# Altium schematic sheet main.SchDoc
size 840 x 594 mm; PageSetup: Record=PageOptions|CenterHorizontal=False|CenterVertical=False|PrintScale=1.00|XCorrection=0.00|YCorrection=0.00|PrintKind=0|BorderSize=5000000|LeftOffset=0|BottomOffset=0|Orientation=2|PaperLength=1000|PaperWidth=1000|Scale=100|PaperSource=15|PrintQuality=-3|MediaType=1|DitherType=10|PrintScaleMode=0|PaperKind=A3|PaperIndex=8; TitleBlock_01a_DocumentName_line1: BoM Converter; TitleBlock_01a_DocumentName_line2: отладочный проект AD; TitleBlock_01b_DocumentType_line1: Схема электрическая; TitleBlock_01b_DocumentType_line2: принципиальная; TitleBlock_02_DocumentDesignator: BCAD.123456.001 Э3; TitleBlock_07_SheetNumber: 1; TitleBlock_08_SheetTotal: 1; TitleBlock_09_Organization: ООО "НИИ БАЦА"; TitleBlock_11a_Name_Designer: Иванов И.И.; TitleBlock_11b_Name_Checker: Петров П.П.; TitleBlock_11c_Name_TechnicalSupervisor: Сидоров С.С.; TitleBlock_11e_Name_NormativeSupervisor: Зюзина В.Н.; TitleBlock_11f_Name_Approver: Горшков А.С.; TitleBlock_13a_SignatureDate_Designer: 07.10.22; TitleBlock_13b_SignatureDate_Checker: 07.10.22; TitleBlock_13c_SignatureDate_TechnicalSupervisor: 07.10.22; TitleBlock_13e_SignatureDate_NormativeSupervisor: 07.10.22; TitleBlock_13f_SignatureDate_Approver: 07.10.22
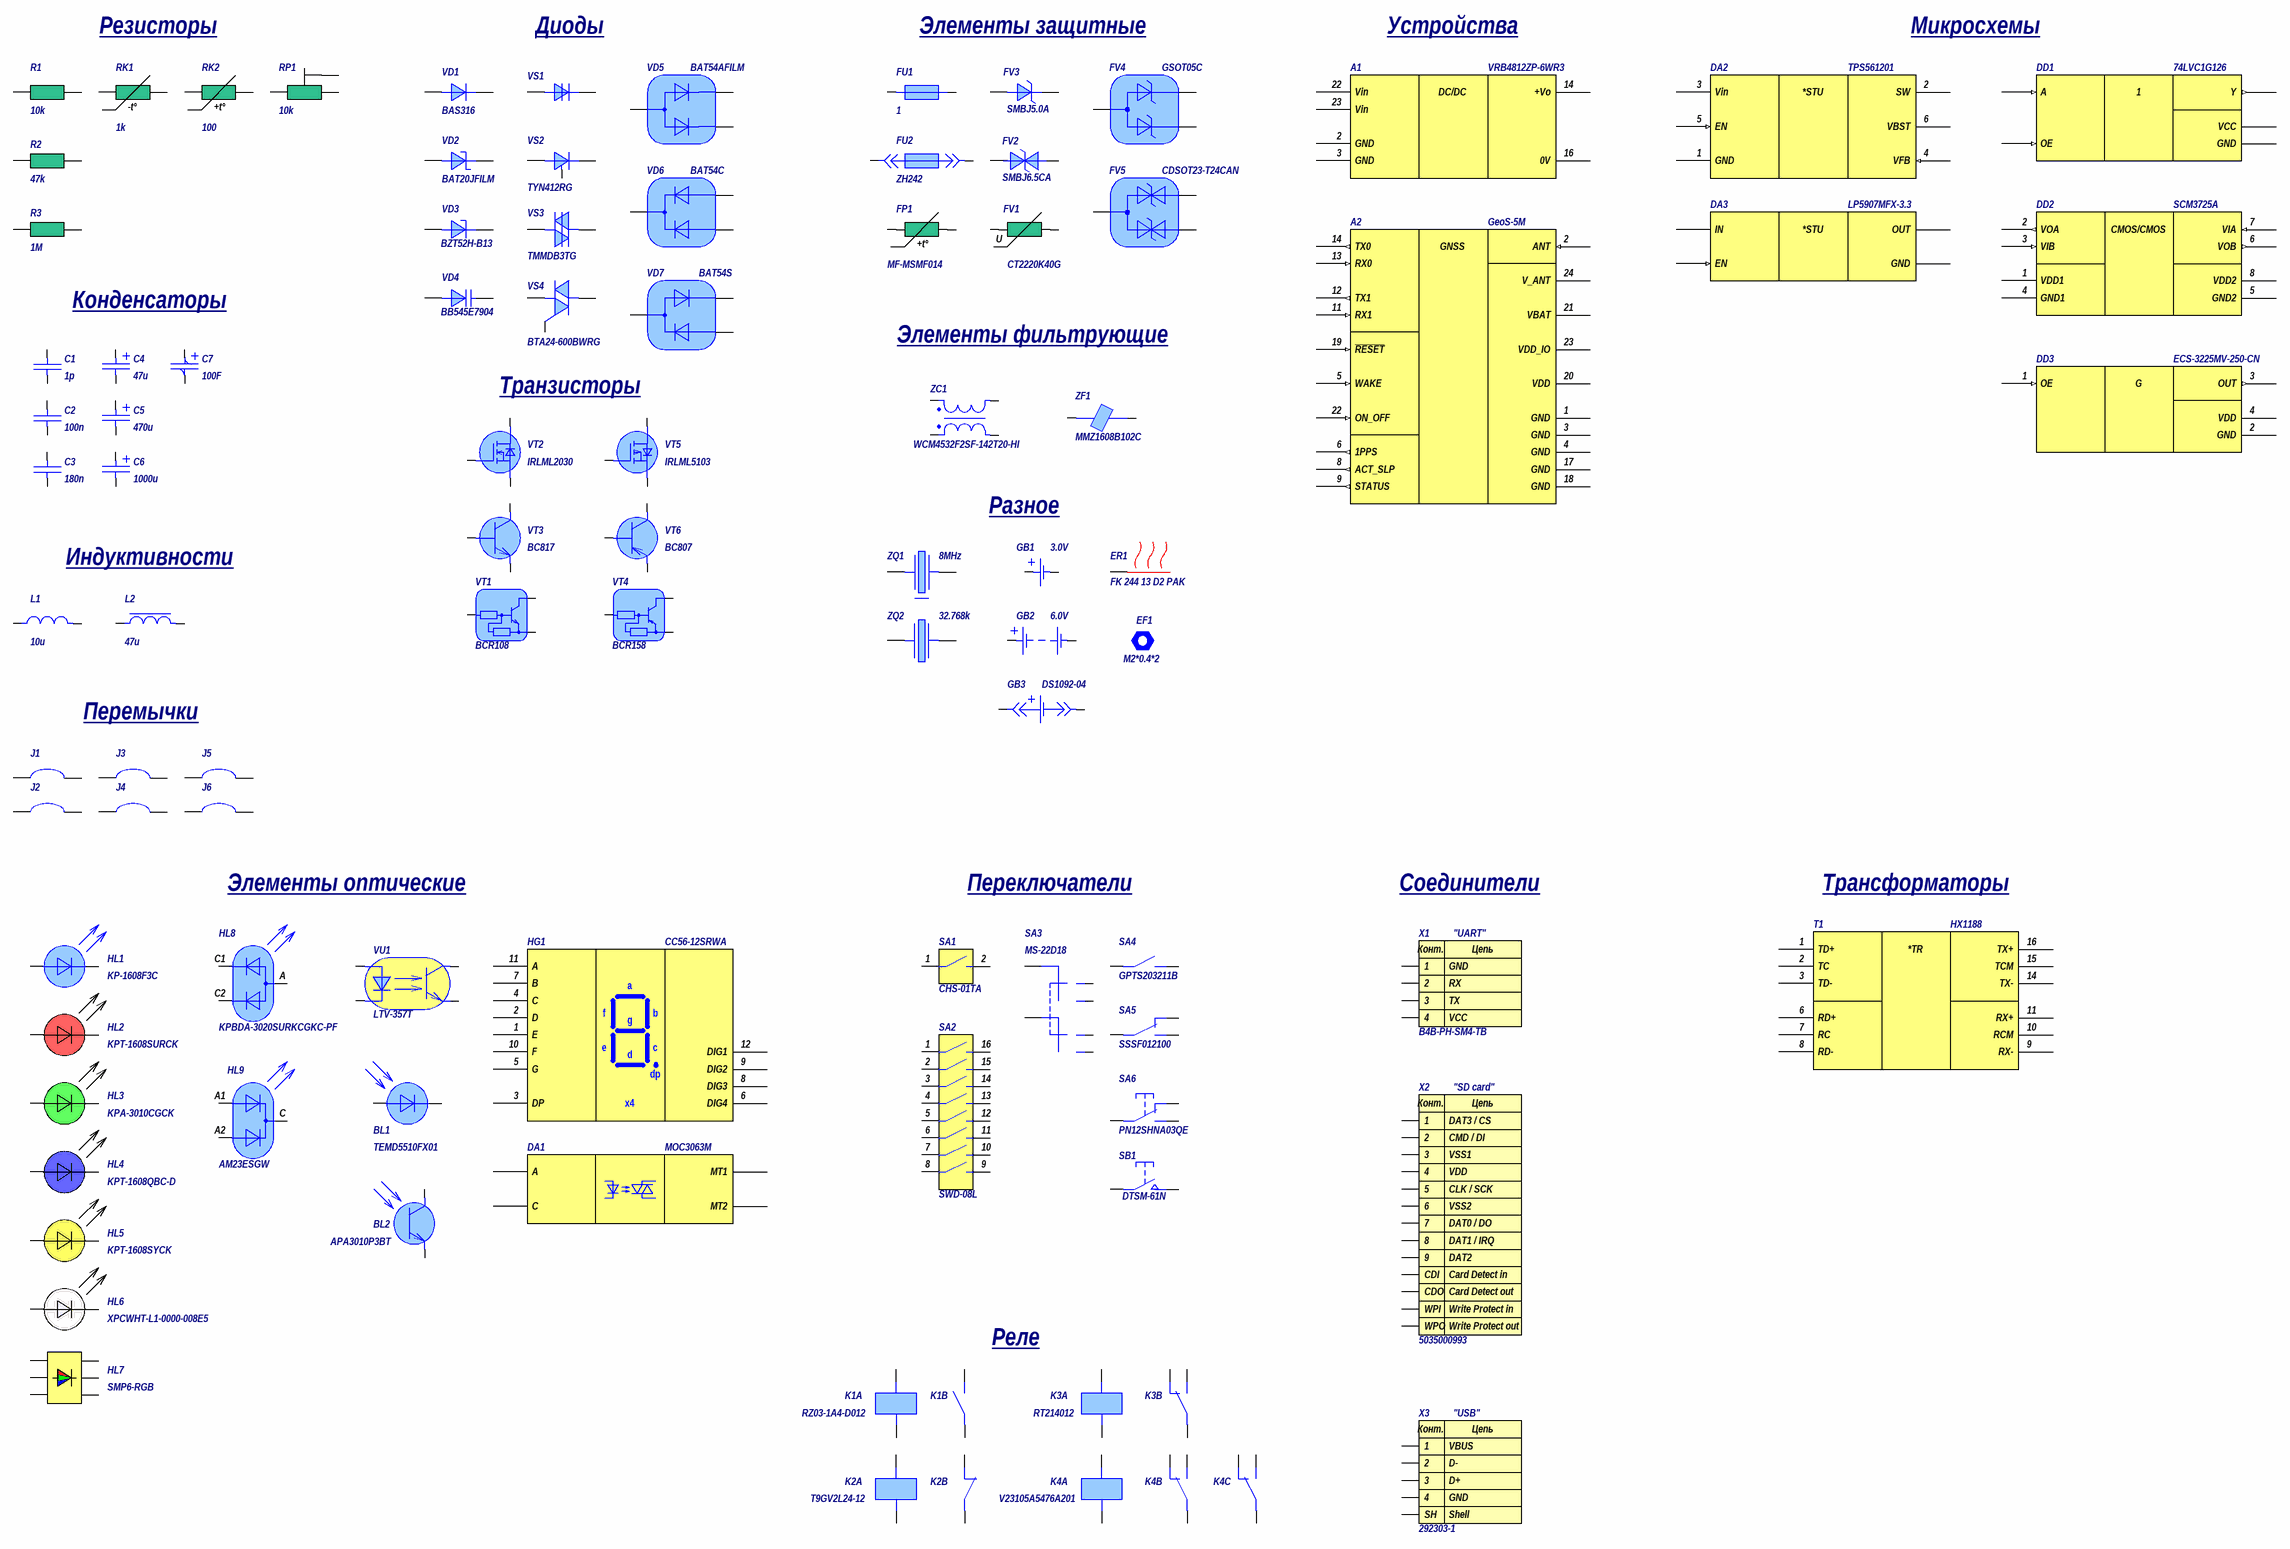
[diagram p0: main.SchDoc]

## Parts
A1  VRB4812ZP-6WR3  [U(V)RB_ZP-6WR3]
A2  GeoS-5M
BL1  TEMD5510FX01  [TEMD5510FX01]
BL2  APA3010P3BT  [PDT_3mm]
C1  1p  [MLCC_0603]
C2  100n  [MLCC_0603]
C3  180n  [SFCC_2416]
C4  47u  [CCM_6032-28 (C)]
C5  470u  [CAP_RTH_18x36-7.5-0.8]
C6  1000u  [CAP_RTH_10x12-5.0-0.6]
C7  100F  [CAP_RTH_20x40-10-0.8_H]
DA1  MOC3063M  [DIP-6]
DA2  TPS561201  [SOT-23-6]
DA3  LP5907MFX-3.3  [SOT-23-5]
DD1  74LVC1G126  [SOT-23-5]
DD2  SCM3725A  [SO-8]
DD3  ECS-3225MV-250-CN  [4-SMD_3225-1.20]
EF1  M2*0.4*2  [SMTSO-M2-2]
ER1  FK 244 13 D2 PAK  [FK244-13-D2PAK]
FP1  MF-MSMF014  SCH_param: +t°  [MF-MSMF-S1]
FU1  1  [FC_2410]
FU2  ZH242  [ZH242]
FV1  CT2220K40G  SCH_param: U  [VC_2220]
FV2  SMBJ6.5CA  [DO-214AA (SMB)]
FV3  SMBJ5.0A  [DO-214AA (SMB)]
FV4  GSOT05C  [SOT-23]
FV5  CDSOT23-T24CAN  [SOT-23]
GB1  3.0V  [CR 1/2 AA S PCBD]
GB2  6.0V
GB3  DS1092-04  [BH-25F-1]
HG1  CC56-12SRWA  [Cx56-12]
HL1  KP-1608F3C  [LEDC_0603-0.75]
HL2  KPT-1608SURCK  [LEDC_0603-0.75]
HL3  KPA-3010CGCK  [LEDC_3020R-1.00]
HL4  KPT-1608QBC-D  [LEDC_0603-0.75]
HL5  KPT-1608SYCK  [LEDC_0603-0.75]
HL6  XPCWHT-L1-0000-008E5  [XP-C]
HL7  SMP6-RGB  [PLCC-6]
HL8  KPBDA-3020SURKCGKC-PF  [KPBDA-3020]
HL9  AM23ESGW
J1  (no value)  [RC_0402]
J2  (no value)  [RC_0402]
J3  (no value)  [RC_0402]
J4  (no value)  [RC_0402]
J5  (no value)  [RC_0402]
J6  (no value)  [RC_0402]
K1  RZ03-1A4-D012  [RZxx-5.0]  (parts A,B of 2)
K2  T9GV2L24-12  (parts A,B of 2)
K3  RT214012  [BS-115C]  (parts A,B of 2)
K4  V23105A5476A201  (parts A,B,C of 3)
L1  10u  [LC_1812]
L2  47u  [SRU1048]
R1  10k  [RC_0603]
R2  47k  [RC_0603]
R3  1M  [RC_0805]
RK1  1k  SCH_param: -t°  [RC_0603]
RK2  100  SCH_param: +t°  [RC_0805]
RP1  10k  [POT_3006P]
SA1  CHS-01TA  [CHS-01A]
SA2  SWD-08L  [SWD-08]
SA3  MS-22D18  [MS-22D18]
SA4  GPTS203211B
SA5  SSSF012100  [SSSF012100]
SA6  PN12SHNA03QE
SB1  DTSM-61N  [DTSM-61]
T1  HX1188  [HX11xx]
VD1  BAS316  [SOD-323]
VD2  BAT20JFILM  [SOD-323]
VD3  BZT52H-B13  [SOD-123F]
VD4  BB545E7904
VD5  BAT54AFILM  [SOT-23]
VD6  BAT54С  [SOT-23]
VD7  BAT54S  [SOT-23]
VS1  (no value)  [DO-201AD]
VS2  TYN412RG
VS3  TMMDB3TG
VS4  BTA24-600BWRG  [TO-220AB-V]
VT1  BCR108  [SOT-23]
VT2  IRLML2030  [SOT-23]
VT3  BC817  [SOT-23]
VT4  BCR158  [SOT-23]
VT5  IRLML5103  [SOT-23]
VT6  BC807  [SOT-23]
VU1  LTV-357T  [SOP-4_2.54]
X1  B4B-PH-SM4-TB  PIN_1_label: GND  PIN_2_label: RX  PIN_3_label: TX  PIN_4_label: VCC  Name: "UART"  [PH-04M SMD]
X2  5035000993  PIN_9_label: DAT2  PIN_8_label: DAT1 / IRQ  PIN_1_label: DAT3 / CS  PIN_2_label: CMD / DI  PIN_3_label: VSS1  PIN_4_label: VDD  PIN_5_label: CLK / SCK  PIN_6_label: VSS2  PIN_7_label: DAT0 / DO  PIN_10_label: Card Detect in  PIN_11_label: Card Detect out  PIN_12_label: Write Protect in  Name: "SD card"  PIN_13_label: Write Protect out  [5035000993]
X3  292303-1  SCH_PIN_1_label: VBUS  SCH_PIN_2_label: D-  SCH_PIN_3_label: D+  SCH_PIN_4_label: GND  SCH_PIN_SH_label: Shell  SCH_name: "USB"  [292303]
ZC1  WCM4532F2SF-142T20-HI  [CMC_4SMD_4.50x3.20x2.80]
ZF1  MMZ1608B102C  [FB_0603]
ZQ1  8MHz  [4-SMD_5032-1.1]
ZQ2  32.768k  [2-SMD_3215-0.9]

## Nets
NetZQ1_G1: ZQ1.G1 ZQ1.G2

Not connected (* = marked no-connect by the designer): A1 2(GND) 3(GND) 14(+Vo) 16(0V) 22(Vin) 23(Vin); A2 1(GND) 2(ANT) 3(GND) 4(GND) 5(WAKE) 6(1PPS) 8(ACT_SLP) 9(STATUS) 11(RX1) 12(TX1) 13(RX0) 14(TX0) 17(GND) 18(GND) 19(~{RESET}) 20(VDD) 21(VBAT) 22(ON_OFF) 23(VDD_IO) 24(V_ANT); BL1 A C; BL2 C E; C1 1 2; C2 1 2; C3 1 2; C4 A C; C5 A C; C6 A C; C7 A C; DA1 A C MT1 MT2; DA2 1(GND) 2(SW) 3(Vin) 4(VFB) 5(EN) 6(VBST); DA3 EN GND IN OUT; DD1 A GND OE VCC Y; DD2 1(VDD1) 2(VOA) 3(VIB) 4(GND1) 5(GND2) 6(VOB) 7(VIA) 8(VDD2); DD3 1(OE) 2(GND) 3(OUT) 4(VDD); EF1 1; ER1 1; FP1 1 2; FU1 1 2; FU2 1 2; FV1 1 2; FV2 A C; FV3 A C; FV4 A C1 C2; FV5 CMN TVS1 TVS2; GB1 A C; GB2 A C; GB3 A C; HG1 1(E) 2(D) 3(DP) 4(C) 5(G) 6(DIG4) 7(B) 8(DIG3) 9(DIG2) 10(F) 11(A) 12(DIG1); HL1 A C; HL2 A C; HL3 A C; HL4 A C; HL5 A C; HL6 A C; HL7 AB AG AR CB CG CR; HL8 A C1 C2; HL9 A1 A2 C; J1 1 2; J2 1 2; J3 1 2; J4 1 2; J5 1 2; J6 1 2; K1 11(C) 14(NO) A1 A2; K2 11(C) 12(NC) A1 A2; K3 11(C) 12(NC) 14(NO) A1 A2; K4 11(C) 12(NC) 14(NO) 21(C) 22(NC) 24(NO) A1 A2; L1 1 2; L2 1 2; R1 1 2; R2 1 2; R3 1 2; RK1 1 2; RK2 1 2; RP1 A B W; SA1 1 2; SA2 1 2 3 4 5 6 7 8 9 10 11 12 13 14 15 16; SA3 11 12 14 21 22 24; SA4 11 14; SA5 11 12 14; SA6 11 12 14; SB1 11 14; T1 1(TD+) 2(TC) 3(TD-) 6(RD+) 7(RC) 8(RD-) 9(RX-) 10(RCM) 11(RX+) 14(TX-) 15(TCM) 16(TX+); VD1 A C; VD2 A C; VD3 A C; VD4 A C; VD5 A C1 C2; VD6 A1 A2 C; VD7 A C MID; VS1 A C; VS2 A C G; VS3 MT1 MT2; VS4 G MT1 MT2; VT1 B C E; VT2 D G S; VT3 B C E; VT4 B C E; VT5 D G S; VT6 B C E; VU1 A CAT COL E; X1 1 2 3 4; X2 1 2 3 4 5 6 7 8 9 CDI CDO WPI WPO; X3 1 2 3 4 SH; ZC1 L1-1 L1-2 L2-1 L2-2; ZF1 1 2; ZQ1 1 2; ZQ2 1 2

## Notes on the sheet
- Резисторы
- Диоды
- Элементы защитные
- Устройства
- Микросхемы
- Конденсаторы
- Элементы фильтрующие
- Транзисторы
- Разное
- Индуктивности
- Перемычки
- Элементы оптические
- Переключатели
- Соединители
- Трансформаторы
- Реле
- Перв. примен.
- Справ. №
- Подп. и дата
- Инв. № дубл.
- Взам. инв. №
- Разраб.
- Изм.
- Лист
- № докум.
- Подп.
- Дата
- Лит.
- Масса
- Масштаб
- Т.контр.
- Пров.
- Листов
- Инв. № подл.
- Утв.
- Н.контр.
- Копировал
- Формат А1
- (in symbol 74*1G126) 1
- (in symbol 5035000993) Конт.; Цепь
- (in symbol Connector table 04) Конт.; Цепь
- (in symbol Cx56-12) a; f; b; g; e; c; d; dp; x4
- (in symbol ECS-3225) G
- (in symbol GeoS-5M) GNSS
- (in symbol H110x) *TR
- (in symbol LP5907) *STU
- (in symbol SCM3725A) CMOS/CMOS
- (in symbol TPS561201) *STU
- (in symbol USB) Конт.; Цепь
- (in symbol VRB_ZP-6WR3) DC/DC

## Library data of the parts
A1 = VRB_ZP-6WR3: 6 Watt isolated DC-DC converter, single output, 1500VDC isolation; BOM_manufacturer: MORNSUN; BOM_type: Устройство; BOM_explicit: true; BOM_value: VRB4812ZP-6WR3; SCH_value: VRB4812ZP-6WR3
A2 = GeoS-5M: GNSS module, ГЛОНАСС, GPS, GALILEO; BOM_manufacturer: Geostar; BOM_type: Устройство; BOM_explicit: true; BOM_value: GeoS-5M; SCH_value: GeoS-5M
BL1 = Photodiode: Generic photodiode; BOM_type: Фотодиод; BOM_explicit: true; BOM_value: TEMD5510FX01; SCH_value: TEMD5510FX01
BL2 = Phototransistor NPN: Generic phototransistor; BOM_type: Фототранзистор; BOM_explicit: true; SCH_value: APA3010P3BT; BOM_value: APA3010P3BT
C1 = Capacitor nonpolar: Nonpolar capacitor, generic; BOM_manufacturer: YAGEO; BOM_value: CC0603BRNPO9BN1R0; BOM_type: Конденсатор; BOM_description: керам., чип 0603, NP0, 1пФ ±0.1пФ, 50В; BOM_explicit: false; SCH_value: 1p
C2 = Capacitor nonpolar: Nonpolar capacitor, generic; BOM_manufacturer: YAGEO; BOM_value: CC0603KRX7R9BB104; BOM_type: Конденсатор; BOM_description: керам., чип 0603, X7R, 0.1мкФ ±10%, 50В; BOM_explicit: false; SCH_value: 100n
C3 = Capacitor nonpolar: Nonpolar capacitor, generic; BOM_manufacturer: Panasonic; BOM_value: ECHU1H184GX9; BOM_type: Конденсатор; BOM_description: плён., чип 2416, PPS, 0.18мкФ ±2%, 50В; BOM_explicit: true; SCH_value: 180n
C4 = Capacitor polar: Polar capacitor, generic; BOM_manufacturer: Vishay; BOM_value: 593D476X9016C; BOM_type: Конденсатор; BOM_description: тантал., чип C, 47мкФ ±10%, 16В; BOM_explicit: true; SCH_value: 47u
C5 = Capacitor polar: Polar capacitor, generic; BOM_manufacturer: EPCOS; BOM_value: B41858C9477M; BOM_type: Конденсатор; BOM_description: алюм. эл-лит, рад. 18*35мм, 470мкФ ±20%, 100В, низк. имп.; BOM_explicit: true; SCH_value: 470u
C6 = Capacitor polar: Polar capacitor, generic; BOM_manufacturer: KEMET; BOM_value: A755MS108M1CAAE012; BOM_type: Конденсатор; BOM_description: алюм. полим., рад. 10*12мм, 1000мкФ ±20%, 16В; BOM_explicit: true; SCH_value: 1000u
C7 = Supercapacitor: BOM_manufacturer: АО «Элеконд»; BOM_value: Конденсатор К58-26 – 2,7В – 100Ф (+50…-20)% – ЕВАЯ.673811.006ТУ; BOM_type: Конденсатор; BOM_description: ионистор, рад. 20*40мм, 100Ф +50…-20%, 2.7В; BOM_explicit: true; SCH_value: 100F
DA1 = PhotoTRIAC: PhotoTRIAC (IC symbol); pin to pad: A>1 C>2 MT1>6 MT2>4; BOM_description: детектор нуля; BOM_type: Оптосимистор; BOM_explicit: true; SCH_value: MOC3063M; BOM_value: MOC3063M
DA2 = TPS561201: Switching 1A step-down voltage regulator; BOM_manufacturer: Texas Instruments; BOM_value: TPS561201DDC; BOM_type: Микросхема; BOM_substitute: TPS562201DDC@Texas Instruments*огр. тока 2А;TPS563201DDC@Texas Instruments*огр. тока 3А; BOM_explicit: true; SCH_value: TPS561201
DA3 = LP5907: Linear 250mA LDO voltage regulator, ultra-low-noise for RF and analog circuits; pin to pad: EN>3 GND>2 IN>1 OUT>5; BOM_manufacturer: Texas Instruments; BOM_type: Микросхема; BOM_explicit: true; BOM_value: LP5907MFX-3.3; SCH_value: LP5907MFX-3.3
DD1 = 74*1G126: Single buffer with 3-state output, non-inverted output enable; pin to pad: A>2 GND>3 OE>1 VCC>5 Y>4; BOM_manufacturer: Texas Instruments; BOM_value: SN74LVC1G126DBV; BOM_type: Микросхема; BOM_explicit: true; SCH_value: 74LVC1G126
DD2 = SCM3725A: Digital isolator (2 unidirectional channels - 1/1); BOM_manufacturer: MORNSUN Guangzhou Science & Technology Co., Ltd.; BOM_value: SCM3725ASA; BOM_type: Микросхема; BOM_explicit: true; SCH_value: SCM3725A
DD3 = ECS-3225: Crystal oscillator; pin to pad: 1>#1 2>#2 3>#3 4>#4; BOM_manufacturer: ECS Inc.; BOM_type: Осциллятор; BOM_description: кварц., 25МГц ±25ppm, -40…85°C; BOM_explicit: true; BOM_value: ECS-3225MV-250-CN; SCH_value: ECS-3225MV-250-CN
EF1 = Fastener: Fastener, generic; BOM_manufacturer: PEM; BOM_value: SMTSO-M2-2ET; BOM_type: Крепёж; BOM_description: стойка, SMD, M2*0.4, 2мм; BOM_explicit: true; SCH_value: M2*0.4*2
ER1 = Heatsink with connection: Heatsink with electrical connection; pin to pad: 1>PAD; BOM_manufacturer: Fischer Elektronik; BOM_type: Радиатор; BOM_explicit: true; BOM_value: FK 244 13 D2 PAK; SCH_value: FK 244 13 D2 PAK
FP1 = PTC resettable fuse: PTC resettable fuse, generic; BOM_manufacturer: Bourns; BOM_description: самовосст., чип 1812, 140мА, 60В; BOM_type: Предохранитель; BOM_explicit: true; BOM_value: MF-MSMF014; SCH_value: MF-MSMF014
FU1 = Fuse: BOM_manufacturer: Littelfuse, Inc.; BOM_value: 0451001.; BOM_type: Предохранитель; BOM_description: плавкий, чип 2410, 1А, 0.6029А²с, быстрый; BOM_explicit: true; SCH_value: 1
FU2 = Fuse holder: BOM_type: Предохранитель; BOM_description: держатель; BOM_explicit: true; BOM_value: ZH242; SCH_value: ZH242
FV1 = Varistor: Varistor, generic; BOM_manufacturer: TDK; BOM_value: B72540T0400K062; BOM_type: Варистор; BOM_description: чип 2220, 68В, 1кА, 9Дж; BOM_explicit: true; SCH_value: CT2220K40G
FV2 = TVS biDir: Transient voltage suppressor - bidirectional; BOM_type: Супрессор; BOM_description: двунаправ., 6.5В, 600Вт @ 10/1000мкс; BOM_explicit: true; BOM_value: SMBJ6.5CA; SCH_value: SMBJ6.5CA
FV3 = TVS uniDir: Transient voltage suppressor - unidirectional; BOM_type: Супрессор; BOM_description: однонаправ., 5В, 600Вт @ 10/1000мкс; BOM_explicit: true; BOM_value: SMBJ5.0A; SCH_value: SMBJ5.0A
FV4 = TVS assembly - 2 uniDir CA: Transient voltage suppressor assembly - 2 unidirectional TVSs with common anode; pin to pad: A>3 C1>1 C2>2; BOM_value: GSOT05C-E3-08; BOM_description: сборка; BOM_type: Супрессор; BOM_explicit: true; SCH_value: GSOT05C
FV5 = TVS assembly - 2 biDir: Transient voltage suppressor assembly - 2 bidirectional TVSs; pin to pad: CMN>3 TVS1>1 TVS2>2; BOM_manufacturer: Bourns; BOM_description: сборка; BOM_type: Супрессор; BOM_explicit: true; BOM_value: CDSOT23-T24CAN; SCH_value: CDSOT23-T24CAN
GB1 = Cell: Battery, single cell, generic; BOM_manufacturer: VARTA; BOM_type: Элемент гальванический; BOM_explicit: true; SCH_value: 3.0V; BOM_value: CR 1/2 AA S PCBD
GB2 = Battery: Battery, multicell, generic; BOM_value: BR-2325/2HAN; BOM_type: Батарея; BOM_explicit: true; SCH_value: 6.0V
GB3 = Cell holder: Battery holder, single cell, generic; BOM_manufacturer: Connfly; BOM_value: DS1092-04-B6P; BOM_type: Элемент гальванический; BOM_description: держатель, CR2032; BOM_substitute: BH-25F-1@Adam Tech;BS-7@Memory Protection Devices; BOM_explicit: true; SCH_value: DS1092-04
HG1 = Cx56-12: 7-segment LED display, 4 digits, 0.56" (14.22mm) digits height; BOM_manufacturer: Kingbright; BOM_type: Дисплей; BOM_description: светодиодный, 7-сегм., красный, сборка 4x8CC; BOM_explicit: true; BOM_value: CC56-12SRWA; SCH_value: CC56-12SRWA
HL1 = LED: Generic LED; BOM_manufacturer: Kingbright; BOM_type: Светодиод; BOM_description: инфракрасный, 940нм, 150°; BOM_explicit: true; BOM_value: KP-1608F3C; SCH_value: KP-1608F3C
HL2 = LED Red: Generic LED Red; BOM_description: красный, 645/630нм, 230мкд @ 20мА, 120°; BOM_type: Светодиод; BOM_explicit: true; BOM_value: KPT-1608SURCK; SCH_value: KPT-1608SURCK
HL3 = LED Green: Generic LED Green; BOM_type: Светодиод; BOM_description: зелёный, 574/570нм, 50мкд @ 20мА, 120°; BOM_explicit: true; BOM_value: KPA-3010CGCK; SCH_value: KPA-3010CGCK
HL4 = LED Blue: Generic LED Blue; BOM_description: синий, 460/465нм, 100мкд @ 20мА, 130°; BOM_type: Светодиод; BOM_explicit: true; BOM_value: KPT-1608QBC-D; SCH_value: KPT-1608QBC-D
HL5 = LED Yellow: Generic LED Yellow; BOM_type: Светодиод; BOM_description: жёлтый, 590нм, 150мкд @ 20мА, 120°; BOM_explicit: true; BOM_value: KPT-1608SYCK; SCH_value: KPT-1608SYCK
HL6 = LED White: Generic LED White; BOM_manufacturer: Cree; BOM_type: Светодиод; BOM_description: белый, 4000K, 73.9лм @ 350мА, CRI 75; BOM_explicit: true; BOM_value: XPCWHT-L1-0000-008E5; SCH_value: XPCWHT-L1-0000-008E5
HL7 = LED RGB: Generic LED RGB; pin to pad: AB>1 AG>3 AR>2 CB>6 CG>4 CR>5; BOM_manufacturer: Bivar; BOM_type: Светодиод; BOM_description: многоцветный; BOM_explicit: true; BOM_value: SMP6-RGB; SCH_value: SMP6-RGB
HL8 = LED Dual CA: Generic dual LED with common anode (two LEDs under common lens); BOM_manufacturer: Kigbright; BOM_type: Светодиод; BOM_description: многоцветный, сборка 1x2CA; BOM_explicit: true; BOM_value: KPBDA-3020SURKCGKC-PF; SCH_value: KPBDA-3020SURKCGKC-PF
HL9 = LED Dual CC: Generic dual LED with common cathode (two LEDs under common lens); BOM_manufacturer: Kingbright; BOM_type: Светодиод; BOM_description: многоцветный, сборка 1x2CC; BOM_explicit: true; BOM_value: AM23ESGW; SCH_value: AM23ESGW
J1-J6 = Jumper: BOM_manufacturer: YAGEO; BOM_value: RC0402JR-070RL; BOM_type: Перемычка; BOM_description: чип 0402; BOM_explicit: false
K1 = Relay SPST-NO: Generic relay Single Pole Single Throw - Normally-Open; BOM_manufacturer: TE Connectivity; BOM_type: Реле; BOM_explicit: true; BOM_value: RZ03-1A4-D012; SCH_value: RZ03-1A4-D012
K2 = Relay SPST-NC: Generic relay Single Pole Single Throw - Normally-Closed; BOM_manufacturer: TE Connectivity; BOM_type: Реле; BOM_explicit: true; BOM_value: T9GV2L24-12; SCH_value: T9GV2L24-12
K3 = Relay SPDT: Generic relay Single Pole Double Throw; BOM_manufacturer: TE Connectivity; BOM_type: Реле; BOM_explicit: true; BOM_value: RT214012; SCH_value: RT214012
K4 = Relay DPDT: Generic relay Double Pole Double Throw; BOM_manufacturer: TE Connectivity; BOM_type: Реле; BOM_explicit: true; BOM_value: V23105A5476A201; SCH_value: V23105A5476A201
L1 = Inductor: BOM_value: NL453232T-100K; BOM_type: Индуктивность; BOM_description: чип 1812, 10мкГн ±10%, 250мА; BOM_explicit: false; SCH_value: 10u
L2 = Choke: BOM_manufacturer: Bourns; BOM_value: SRU1048-470Y; BOM_type: Дроссель; BOM_description: 47мкГн ±30%, 1.5А; BOM_explicit: true; SCH_value: 47u
R1 = Resistor: Fixed-value resistor, generic; BOM_manufacturer: YAGEO; BOM_value: RC0603JR-0710KL; BOM_type: Резистор; BOM_description: чип 0603, 10кОм ±5%; BOM_explicit: false; SCH_value: 10k
R2 = Resistor: Fixed-value resistor, generic; BOM_manufacturer: YAGEO; BOM_value: RT0603DRD0747KL; BOM_type: Резистор; BOM_description: чип 0603, 47кОм ±0.5%, ±25ppm/°C; BOM_explicit: false; SCH_value: 47k
R3 = Resistor: Fixed-value resistor, generic; BOM_manufacturer: YAGEO; BOM_value: RV0805JR-071ML; BOM_type: Резистор; BOM_description: чип 0805, 10кОм ±5%, 400В; BOM_explicit: true; SCH_value: 1M
RK1 = Thermistor: Thermistor (NTC), generic; BOM_manufacturer: Murata; BOM_value: NCP18XQ102J03RB; BOM_description: чип 0603, 1кОм ±5%; BOM_type: Термистор; BOM_explicit: true; SCH_value: 1k
RK2 = Posistor: Posistor (PTC), generic; BOM_manufacturer: Vishay; BOM_value: TFPT0805L1000FV; BOM_description: чип 0805, 100Ом ±1%; BOM_type: Позистор; BOM_explicit: true; SCH_value: 100
RP1 = Trimmer: Trimming potentiometer, generic; BOM_manufacturer: Bourns; BOM_value: 3006P-1-103; BOM_type: Резистор; BOM_description: подстроечный, 10кОм ±10%, лин. хар-ка; BOM_explicit: true; SCH_value: 10k
SA1 = Switch DIP 01: DIP Switch, 1 element; BOM_manufacturer: Copal Electronics Inc.; BOM_type: Переключатель; BOM_explicit: true; SCH_value: CHS-01TA; BOM_value: CHS-01TA
SA2 = Switch DIP 08: DIP Switch, 8 independent elements; BOM_type: Переключатель; BOM_explicit: true; SCH_value: SWD-08L; BOM_value: SWD-08L
SA3 = Switch DPDT slide: Generic switch Double Pole Double Throw, slide; BOM_description: движковый; BOM_type: Переключатель; BOM_explicit: true; SCH_value: MS-22D18; BOM_value: MS-22D18
SA4 = Switch SPST-NO: Generic switch Single Pole Single Throw - Normally-Open; BOM_manufacturer: CW Industries; BOM_type: Выключатель; BOM_explicit: true; SCH_value: GPTS203211B; BOM_value: GPTS203211B
SA5 = Switch SPDT: Generic switch Single Pole Double Throw; BOM_type: Переключатель; BOM_explicit: true; SCH_value: SSSF012100; BOM_value: SSSF012100
SA6 = Switch SPDT button: Generic switch Single Pole Double Throw, button with automatic reset; BOM_manufacturer: C&K; BOM_type: Переключатель; BOM_explicit: true; SCH_value: PN12SHNA03QE; BOM_value: PN12SHNA03QE
SB1 = Switch SPST-NO unlatched button: Generic switch Single Pole Single Throw - Normally-Open, unlatched button with automatic reset; BOM_manufacturer: Diptronics; BOM_description: кнопочный; BOM_type: Выключатель; BOM_explicit: true; SCH_value: DTSM-61N; BOM_value: DTSM-61N
T1 = H110x: Ethernet 10/100Base-T single port SMD transformer; BOM_manufacturer: Pulse; BOM_value: HX1188NL; BOM_type: Трансформатор; BOM_description: сборка; BOM_explicit: true; SCH_value: HX1188
VD1 = Diode: Generic diode; BOM_type: Диод; BOM_description: общ. прим., 250мА, 100В; BOM_explicit: true; BOM_value: BAS316; SCH_value: BAS316
VD2 = Diode Shottky: Shottky diode; BOM_type: Диод; BOM_description: Шоттки, 1А, 23В; BOM_explicit: true; BOM_value: BAT20JFILM; SCH_value: BAT20JFILM
VD3 = Diode Zener: Zener diode; BOM_type: Стабилитрон; BOM_description: 13В ±2%, 0.83Вт; BOM_explicit: true; BOM_value: BZT52H-B13; SCH_value: BZT52H-B13
VD4 = Varicap: Generic varicap; BOM_manufacturer: Infineon; BOM_type: Варикап; BOM_explicit: true; BOM_value: BB545E7904; SCH_value: BB545E7904
VD5 = Diode assembly - 2CA: Diode assembly - 2 diodes with common anode; pin to pad: A>3 C1>1 C2>2; BOM_description: Шоттки, 300мА, 40В, сборка 1x2A; BOM_type: Диод; BOM_explicit: true; BOM_value: BAT54AFILM; SCH_value: BAT54AFILM
VD6 = Diode assembly - 2CC: Diode assembly - 2 diodes with common cathode; pin to pad: A1>1 A2>2 C>3; BOM_value: BAT54СFILM; BOM_description: Шоттки, 300мА, 40В, сборка 1x2C; BOM_type: Диод; BOM_explicit: true; SCH_value: BAT54С
VD7 = Diode assembly - 2SER: Diode assembly - 2 diodes with series connection; pin to pad: A>1 C>2 MID>3; BOM_value: BAT54SFILM; BOM_description: Шоттки, 300мА, 40В, сборка 1x2S; BOM_type: Диод; BOM_explicit: true; SCH_value: BAT54S
VS1 = Dynistor: Generic dynistor; BOM_type: Динистор; BOM_explicit: true
VS2 = Thyristor: Generic thyristor; BOM_manufacturer: ST Microelectronics; BOM_type: Тиристор; BOM_description: 400В, 12А, 15мА; BOM_explicit: true; BOM_value: TYN412RG; SCH_value: TYN412RG
VS3 = DIAC: Generic DIAC; BOM_manufacturer: ST Microelectronics; BOM_type: Динистор; BOM_description: двунаправ., 32В, 2А, 15мкА; BOM_explicit: true; BOM_value: TMMDB3TG; SCH_value: TMMDB3TG
VS4 = TRIAC: Generic TRIAC; pin to pad: G>3 MT1>1 MT2>2; BOM_type: Симистор; BOM_explicit: true; BOM_value: BTA24-600BWRG; SCH_value: BTA24-600BWRG
VT1 = Bipolar Digital NPN: Bipolar digital NPN single transistor; pin to pad: B>1 C>3 E>2; BOM_type: Транзистор; BOM_description: биполярный цифровой; BOM_explicit: true; SCH_value: BCR108; BOM_value: BCR108
VT2 = MOSFET N-Channel: pin to pad: D>3 G>1 S>2; BOM_type: Транзистор; BOM_explicit: true; SCH_value: IRLML2030; BOM_value: IRLML2030
VT3 = Bipolar NPN: Bipolar NPN transistor; pin to pad: B>1 C>3 E>2; BOM_type: Транзистор; BOM_explicit: true; SCH_value: BC817; BOM_value: BC817
VT4 = Bipolar Digital PNP: Bipolar digital PNP single transistor; pin to pad: B>1 C>3 E>2; BOM_description: биполярный цифровой; BOM_type: Транзистор; BOM_explicit: true; SCH_value: BCR158; BOM_value: BCR158
VT5 = MOSFET P-Channel: pin to pad: D>3 G>1 S>2; BOM_type: Транзистор; BOM_explicit: true; SCH_value: IRLML5103; BOM_value: IRLML5103
VT6 = Bipolar PNP: Bipolar PNP transistor; pin to pad: B>1 C>3 E>2; BOM_type: Транзистор; BOM_explicit: true; SCH_value: BC807; BOM_value: BC807
VU1 = Optocoupler NPN: pin to pad: A>1 CAT>2 COL>4 E>3; BOM_type: Оптопара; BOM_explicit: true; SCH_value: LTV-357T; BOM_value: LTV-357T
X1 = Connector table 04: Generic table-layout connector, 4 pin; BOM_type: Соединитель; BOM_explicit: true; SCH_value: B4B-PH-SM4-TB; BOM_value: B4B-PH-SM4-TB
X2 = 5035000993: SD card connector with separate card detect and write protect; BOM_manufacturer: Molex; BOM_type: Соединитель; BOM_substitute: 5035000991; BOM_explicit: true; SCH_value: 5035000993; BOM_value: 5035000993
X3 = USB: USB standard connector; BOM_manufacturer: TE Connectivity; BOM_type: Соединитель; BOM_description: розетка; BOM_explicit: true; SCH_value: 292303-1; BOM_value: 292303-1
ZC1 = Common mode choke: pin to pad: L1-1>1 L1-2>4 L2-1>2 L2-2>3; BOM_manufacturer: TAI-TECH Advanced Electronics Co., Ltd.; BOM_type: Фильтр ЭМП; BOM_description: синфазный дроссель, 1.4кОм @ 100МГц, 2А, 0.1Ом @ DC; BOM_explicit: true; BOM_value: WCM4532F2SF-142T20-HI; SCH_value: WCM4532F2SF-142T20-HI
ZF1 = Ferrite Bead: BOM_manufacturer: TDK; BOM_type: Фильтр ЭМП; BOM_description: ферритовая бусина, чип 0603, 1000Ом ±25% @ 100МГц, 300мА, 600мОм @ DC; BOM_explicit: true; BOM_value: MMZ1608B102C; SCH_value: MMZ1608B102C
ZQ1 = Crystal G2: Crystal resonator with ground connection (2 pins), generic; pin to pad: 1>#1 2>#3 G1>#4 G2>#2; BOM_manufacturer: Diodes Incorporated; BOM_value: FY0800018; BOM_type: Резонатор; BOM_description: кварцевый, 8МГц ±30ppm, 18пФ, 100Ом, фунд., -40…85°C; BOM_explicit: true; SCH_value: 8MHz
ZQ2 = Crystal: Crystal resonator, generic; BOM_manufacturer: Abracon; BOM_value: ABS07-32.768KHZ-T; BOM_type: Резонатор; BOM_description: кварцевый, 32.768кГц ±20ppm, 12.5пФ, 70кОм, -40…85°C; BOM_explicit: true; SCH_value: 32.768k